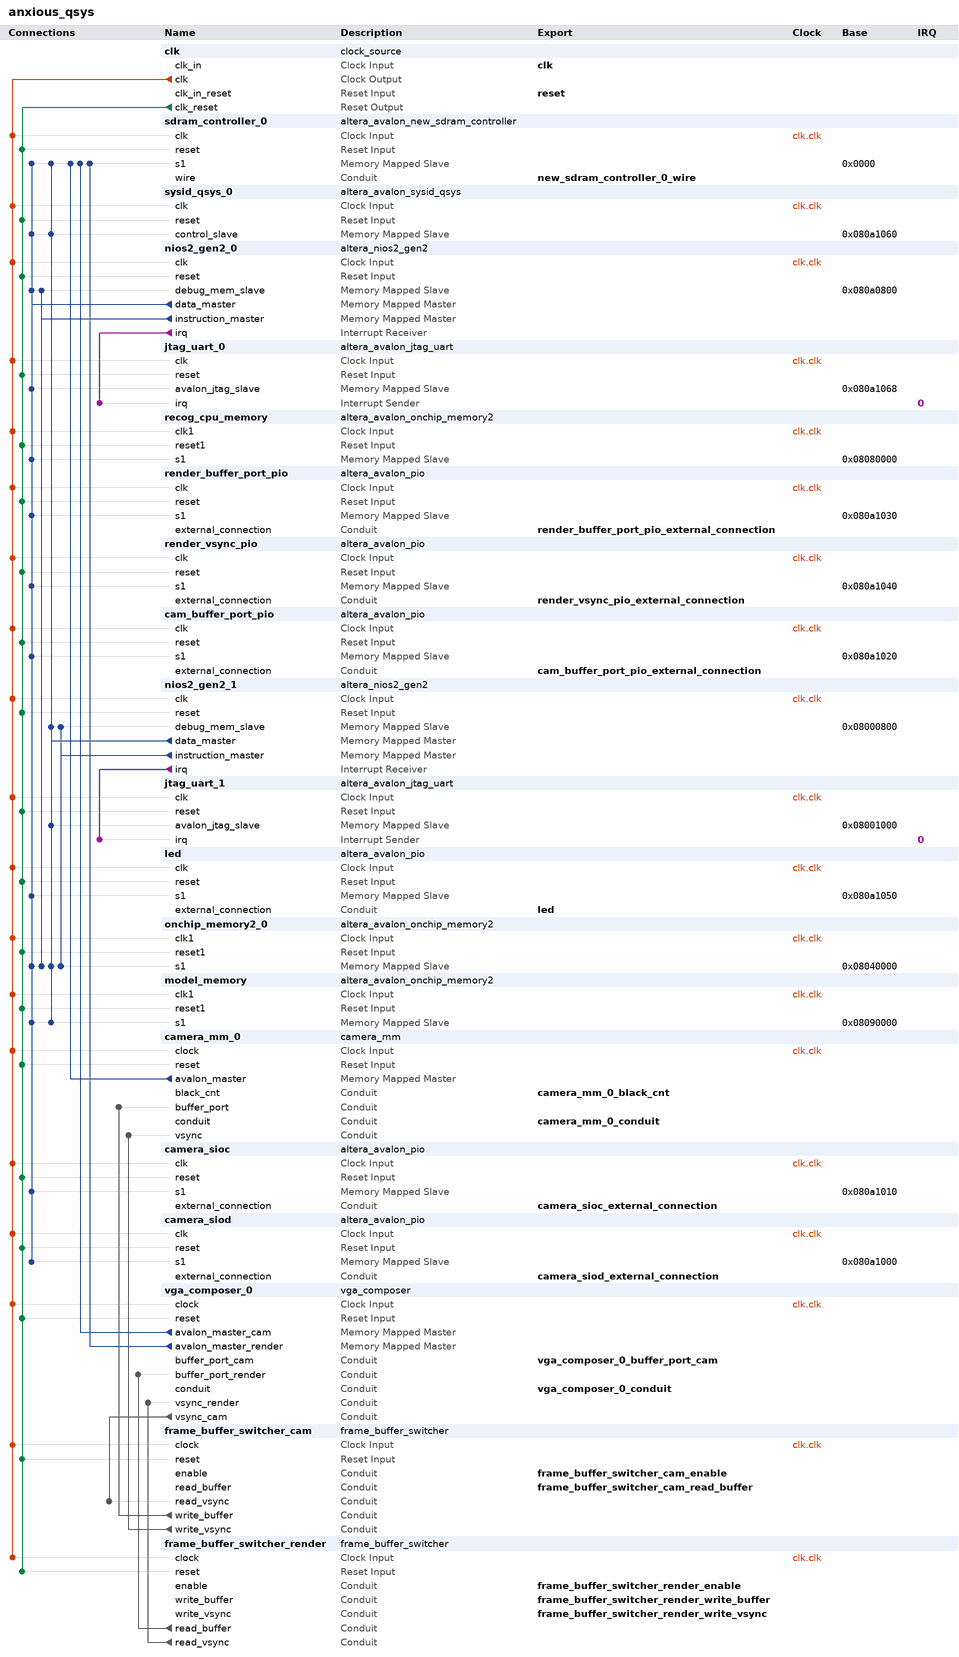
[diagram p0: system contents]
# Platform Designer (Qsys) system anxious_qsys, Cyclone IV GX EP4CGX150DF31C7
# Parameters at their usual value, and those the tool derives, are not listed.
package require -exact qsys 15.0
create_system anxious_qsys
set_project_property DEVICE_FAMILY {Cyclone IV GX}
set_project_property DEVICE EP4CGX150DF31C7

add_instance clk clock_source 15.0
set_instance_parameter_value clk clockFrequency 50000000

add_instance sdram_controller_0 altera_avalon_new_sdram_controller 15.0
set_instance_parameter_value sdram_controller_0 TAC 5.5
set_instance_parameter_value sdram_controller_0 TRCD 20.0
set_instance_parameter_value sdram_controller_0 TRP 20.0
set_instance_parameter_value sdram_controller_0 casLatency 3
set_instance_parameter_value sdram_controller_0 columnWidth 10
set_instance_parameter_value sdram_controller_0 dataWidth 32
set_instance_parameter_value sdram_controller_0 generateSimulationModel true
set_instance_parameter_value sdram_controller_0 initRefreshCommands 8
set_instance_parameter_value sdram_controller_0 model single_Micron_MT48LC4M32B2_7_chip
set_instance_parameter_value sdram_controller_0 numberOfBanks 4
set_instance_parameter_value sdram_controller_0 numberOfChipSelects 1
set_instance_parameter_value sdram_controller_0 powerUpDelay 100.0
set_instance_parameter_value sdram_controller_0 refreshPeriod 7.8125
set_instance_parameter_value sdram_controller_0 rowWidth 13

add_instance sysid_qsys_0 altera_avalon_sysid_qsys 15.0
set_instance_parameter_value sysid_qsys_0 id 286331153

add_instance nios2_gen2_0 altera_nios2_gen2 15.0
set_instance_parameter_value nios2_gen2_0 dcache_size 4096
set_instance_parameter_value nios2_gen2_0 dividerType srt2
set_instance_parameter_value nios2_gen2_0 exceptionSlave onchip_memory2_0.s1
set_instance_parameter_value nios2_gen2_0 icache_size 4096
set_instance_parameter_value nios2_gen2_0 impl Fast
set_instance_parameter_value nios2_gen2_0 resetSlave onchip_memory2_0.s1

add_instance jtag_uart_0 altera_avalon_jtag_uart 15.0
set_instance_parameter_value jtag_uart_0 simInteractiveOptions NO_INTERACTIVE_WINDOWS

add_instance recog_cpu_memory altera_avalon_onchip_memory2 15.0
set_instance_parameter_value recog_cpu_memory dataWidth 32
set_instance_parameter_value recog_cpu_memory dualPort false
set_instance_parameter_value recog_cpu_memory initMemContent true
set_instance_parameter_value recog_cpu_memory initializationFileName onchip_mem.hex
set_instance_parameter_value recog_cpu_memory memorySize 65536

add_instance render_buffer_port_pio altera_avalon_pio 15.0
set_instance_parameter_value render_buffer_port_pio direction Input
set_instance_parameter_value render_buffer_port_pio width 2

add_instance render_vsync_pio altera_avalon_pio 15.0
set_instance_parameter_value render_vsync_pio direction Output
set_instance_parameter_value render_vsync_pio width 1

add_instance cam_buffer_port_pio altera_avalon_pio 15.0
set_instance_parameter_value cam_buffer_port_pio direction Input
set_instance_parameter_value cam_buffer_port_pio width 2

add_instance nios2_gen2_1 altera_nios2_gen2 15.0
set_instance_parameter_value nios2_gen2_1 cpuID 1
set_instance_parameter_value nios2_gen2_1 dcache_size 2048
set_instance_parameter_value nios2_gen2_1 exceptionOffset 90144
set_instance_parameter_value nios2_gen2_1 exceptionSlave onchip_memory2_0.s1
set_instance_parameter_value nios2_gen2_1 icache_size 4096
set_instance_parameter_value nios2_gen2_1 impl Fast
set_instance_parameter_value nios2_gen2_1 mul_64_impl 1
set_instance_parameter_value nios2_gen2_1 resetOffset 90112
set_instance_parameter_value nios2_gen2_1 resetSlave onchip_memory2_0.s1

add_instance jtag_uart_1 altera_avalon_jtag_uart 15.0
set_instance_parameter_value jtag_uart_1 simInteractiveOptions NO_INTERACTIVE_WINDOWS

add_instance led altera_avalon_pio 15.0
set_instance_parameter_value led direction Output
set_instance_parameter_value led width 8

add_instance onchip_memory2_0 altera_avalon_onchip_memory2 15.0
set_instance_parameter_value onchip_memory2_0 dataWidth 32
set_instance_parameter_value onchip_memory2_0 dualPort false
set_instance_parameter_value onchip_memory2_0 initMemContent true
set_instance_parameter_value onchip_memory2_0 initializationFileName onchip_mem.hex
set_instance_parameter_value onchip_memory2_0 memorySize 204800

add_instance model_memory altera_avalon_onchip_memory2 15.0
set_instance_parameter_value model_memory dataWidth 32
set_instance_parameter_value model_memory dualPort false
set_instance_parameter_value model_memory initMemContent true
set_instance_parameter_value model_memory initializationFileName onchip_mem.hex
set_instance_parameter_value model_memory memorySize 65536

add_instance camera_mm_0 camera_mm 2.0
set_instance_parameter_value camera_mm_0 ADDR_WIDTH 27
set_instance_parameter_value camera_mm_0 BANK 0
set_instance_parameter_value camera_mm_0 DATA_WIDTH 32
set_instance_parameter_value camera_mm_0 FIFO_LENGTH_LOG_2 6
set_instance_parameter_value camera_mm_0 FRAME_PIXELS 307200

add_instance camera_sioc altera_avalon_pio 15.0
set_instance_parameter_value camera_sioc direction Output
set_instance_parameter_value camera_sioc width 1

add_instance camera_siod altera_avalon_pio 15.0
set_instance_parameter_value camera_siod direction Bidir
set_instance_parameter_value camera_siod width 1

add_instance vga_composer_0 vga_composer 1.0
set_instance_parameter_value vga_composer_0 ADDR_WIDTH 27
set_instance_parameter_value vga_composer_0 CAM_BANK 0
set_instance_parameter_value vga_composer_0 DATA_WIDTH 32
set_instance_parameter_value vga_composer_0 FIFO_LENGTH_LOG_2 6
set_instance_parameter_value vga_composer_0 RENDER_BANK 1

add_instance frame_buffer_switcher_cam frame_buffer_switcher 1.0

add_instance frame_buffer_switcher_render frame_buffer_switcher 1.0

# connections
add_connection clk.clk cam_buffer_port_pio.clk clock
add_connection clk.clk camera_mm_0.clock clock
add_connection clk.clk camera_sioc.clk clock
add_connection clk.clk camera_siod.clk clock
add_connection clk.clk frame_buffer_switcher_cam.clock clock
add_connection clk.clk frame_buffer_switcher_render.clock clock
add_connection clk.clk jtag_uart_0.clk clock
add_connection clk.clk jtag_uart_1.clk clock
add_connection clk.clk led.clk clock
add_connection clk.clk model_memory.clk1 clock
add_connection clk.clk nios2_gen2_0.clk clock
add_connection clk.clk nios2_gen2_1.clk clock
add_connection clk.clk onchip_memory2_0.clk1 clock
add_connection clk.clk recog_cpu_memory.clk1 clock
add_connection clk.clk render_buffer_port_pio.clk clock
add_connection clk.clk render_vsync_pio.clk clock
add_connection clk.clk sdram_controller_0.clk clock
add_connection clk.clk sysid_qsys_0.clk clock
add_connection clk.clk vga_composer_0.clock clock
add_connection clk.clk_reset cam_buffer_port_pio.reset reset
add_connection clk.clk_reset camera_mm_0.reset reset
add_connection clk.clk_reset camera_sioc.reset reset
add_connection clk.clk_reset camera_siod.reset reset
add_connection clk.clk_reset frame_buffer_switcher_cam.reset reset
add_connection clk.clk_reset frame_buffer_switcher_render.reset reset
add_connection clk.clk_reset jtag_uart_0.reset reset
add_connection clk.clk_reset jtag_uart_1.reset reset
add_connection clk.clk_reset led.reset reset
add_connection clk.clk_reset model_memory.reset1 reset
add_connection clk.clk_reset nios2_gen2_0.reset reset
add_connection clk.clk_reset nios2_gen2_1.reset reset
add_connection clk.clk_reset onchip_memory2_0.reset1 reset
add_connection clk.clk_reset recog_cpu_memory.reset1 reset
add_connection clk.clk_reset render_buffer_port_pio.reset reset
add_connection clk.clk_reset render_vsync_pio.reset reset
add_connection clk.clk_reset sdram_controller_0.reset reset
add_connection clk.clk_reset sysid_qsys_0.reset reset
add_connection clk.clk_reset vga_composer_0.reset reset
add_connection camera_mm_0.avalon_master sdram_controller_0.s1 avalon
set_connection_parameter_value camera_mm_0.avalon_master/sdram_controller_0.s1 baseAddress 0x0000
add_connection nios2_gen2_0.data_master cam_buffer_port_pio.s1 avalon
set_connection_parameter_value nios2_gen2_0.data_master/cam_buffer_port_pio.s1 baseAddress 0x080a1020
add_connection nios2_gen2_0.data_master camera_sioc.s1 avalon
set_connection_parameter_value nios2_gen2_0.data_master/camera_sioc.s1 baseAddress 0x080a1010
add_connection nios2_gen2_0.data_master camera_siod.s1 avalon
set_connection_parameter_value nios2_gen2_0.data_master/camera_siod.s1 baseAddress 0x080a1000
add_connection nios2_gen2_0.data_master jtag_uart_0.avalon_jtag_slave avalon
set_connection_parameter_value nios2_gen2_0.data_master/jtag_uart_0.avalon_jtag_slave baseAddress 0x080a1068
add_connection nios2_gen2_0.data_master led.s1 avalon
set_connection_parameter_value nios2_gen2_0.data_master/led.s1 baseAddress 0x080a1050
add_connection nios2_gen2_0.data_master model_memory.s1 avalon
set_connection_parameter_value nios2_gen2_0.data_master/model_memory.s1 baseAddress 0x08090000
add_connection nios2_gen2_0.data_master nios2_gen2_0.debug_mem_slave avalon
set_connection_parameter_value nios2_gen2_0.data_master/nios2_gen2_0.debug_mem_slave baseAddress 0x080a0800
add_connection nios2_gen2_0.data_master onchip_memory2_0.s1 avalon
set_connection_parameter_value nios2_gen2_0.data_master/onchip_memory2_0.s1 baseAddress 0x08040000
add_connection nios2_gen2_0.data_master recog_cpu_memory.s1 avalon
set_connection_parameter_value nios2_gen2_0.data_master/recog_cpu_memory.s1 baseAddress 0x08080000
add_connection nios2_gen2_0.data_master render_buffer_port_pio.s1 avalon
set_connection_parameter_value nios2_gen2_0.data_master/render_buffer_port_pio.s1 baseAddress 0x080a1030
add_connection nios2_gen2_0.data_master render_vsync_pio.s1 avalon
set_connection_parameter_value nios2_gen2_0.data_master/render_vsync_pio.s1 baseAddress 0x080a1040
add_connection nios2_gen2_0.data_master sdram_controller_0.s1 avalon
set_connection_parameter_value nios2_gen2_0.data_master/sdram_controller_0.s1 baseAddress 0x0000
add_connection nios2_gen2_0.data_master sysid_qsys_0.control_slave avalon
set_connection_parameter_value nios2_gen2_0.data_master/sysid_qsys_0.control_slave baseAddress 0x080a1060
add_connection nios2_gen2_0.instruction_master nios2_gen2_0.debug_mem_slave avalon
set_connection_parameter_value nios2_gen2_0.instruction_master/nios2_gen2_0.debug_mem_slave baseAddress 0x080a0800
add_connection nios2_gen2_0.instruction_master onchip_memory2_0.s1 avalon
set_connection_parameter_value nios2_gen2_0.instruction_master/onchip_memory2_0.s1 baseAddress 0x08040000
add_connection nios2_gen2_1.data_master jtag_uart_1.avalon_jtag_slave avalon
set_connection_parameter_value nios2_gen2_1.data_master/jtag_uart_1.avalon_jtag_slave baseAddress 0x08001000
add_connection nios2_gen2_1.data_master model_memory.s1 avalon
set_connection_parameter_value nios2_gen2_1.data_master/model_memory.s1 baseAddress 0x08090000
add_connection nios2_gen2_1.data_master nios2_gen2_1.debug_mem_slave avalon
set_connection_parameter_value nios2_gen2_1.data_master/nios2_gen2_1.debug_mem_slave baseAddress 0x08000800
add_connection nios2_gen2_1.data_master onchip_memory2_0.s1 avalon
set_connection_parameter_value nios2_gen2_1.data_master/onchip_memory2_0.s1 baseAddress 0x08040000
add_connection nios2_gen2_1.data_master sdram_controller_0.s1 avalon
set_connection_parameter_value nios2_gen2_1.data_master/sdram_controller_0.s1 baseAddress 0x0000
add_connection nios2_gen2_1.data_master sysid_qsys_0.control_slave avalon
set_connection_parameter_value nios2_gen2_1.data_master/sysid_qsys_0.control_slave baseAddress 0x080a1060
add_connection nios2_gen2_1.instruction_master nios2_gen2_1.debug_mem_slave avalon
set_connection_parameter_value nios2_gen2_1.instruction_master/nios2_gen2_1.debug_mem_slave baseAddress 0x08000800
add_connection nios2_gen2_1.instruction_master onchip_memory2_0.s1 avalon
set_connection_parameter_value nios2_gen2_1.instruction_master/onchip_memory2_0.s1 baseAddress 0x08040000
add_connection vga_composer_0.avalon_master_cam sdram_controller_0.s1 avalon
set_connection_parameter_value vga_composer_0.avalon_master_cam/sdram_controller_0.s1 baseAddress 0x0000
add_connection vga_composer_0.avalon_master_render sdram_controller_0.s1 avalon
set_connection_parameter_value vga_composer_0.avalon_master_render/sdram_controller_0.s1 baseAddress 0x0000
add_connection frame_buffer_switcher_cam.write_buffer camera_mm_0.buffer_port conduit
add_connection frame_buffer_switcher_cam.write_vsync camera_mm_0.vsync conduit
add_connection frame_buffer_switcher_render.read_buffer vga_composer_0.buffer_port_render conduit
add_connection frame_buffer_switcher_render.read_vsync vga_composer_0.vsync_render conduit
add_connection vga_composer_0.vsync_cam frame_buffer_switcher_cam.read_vsync conduit
add_connection nios2_gen2_0.irq jtag_uart_0.irq interrupt
set_connection_parameter_value nios2_gen2_0.irq/jtag_uart_0.irq irqNumber 0
add_connection nios2_gen2_1.irq jtag_uart_1.irq interrupt
set_connection_parameter_value nios2_gen2_1.irq/jtag_uart_1.irq irqNumber 0

# exported interfaces
add_interface cam_buffer_port_pio_external_connection conduit end
set_interface_property cam_buffer_port_pio_external_connection EXPORT_OF cam_buffer_port_pio.external_connection
add_interface camera_mm_0_black_cnt conduit end
set_interface_property camera_mm_0_black_cnt EXPORT_OF camera_mm_0.black_cnt
add_interface camera_mm_0_conduit conduit end
set_interface_property camera_mm_0_conduit EXPORT_OF camera_mm_0.conduit
add_interface camera_sioc_external_connection conduit end
set_interface_property camera_sioc_external_connection EXPORT_OF camera_sioc.external_connection
add_interface camera_siod_external_connection conduit end
set_interface_property camera_siod_external_connection EXPORT_OF camera_siod.external_connection
add_interface clk clock sink
set_interface_property clk EXPORT_OF clk.clk_in
add_interface frame_buffer_switcher_cam_enable conduit end
set_interface_property frame_buffer_switcher_cam_enable EXPORT_OF frame_buffer_switcher_cam.enable
add_interface frame_buffer_switcher_cam_read_buffer conduit end
set_interface_property frame_buffer_switcher_cam_read_buffer EXPORT_OF frame_buffer_switcher_cam.read_buffer
add_interface frame_buffer_switcher_render_enable conduit end
set_interface_property frame_buffer_switcher_render_enable EXPORT_OF frame_buffer_switcher_render.enable
add_interface frame_buffer_switcher_render_write_buffer conduit end
set_interface_property frame_buffer_switcher_render_write_buffer EXPORT_OF frame_buffer_switcher_render.write_buffer
add_interface frame_buffer_switcher_render_write_vsync conduit end
set_interface_property frame_buffer_switcher_render_write_vsync EXPORT_OF frame_buffer_switcher_render.write_vsync
add_interface led conduit end
set_interface_property led EXPORT_OF led.external_connection
add_interface new_sdram_controller_0_wire conduit end
set_interface_property new_sdram_controller_0_wire EXPORT_OF sdram_controller_0.wire
add_interface render_buffer_port_pio_external_connection conduit end
set_interface_property render_buffer_port_pio_external_connection EXPORT_OF render_buffer_port_pio.external_connection
add_interface render_vsync_pio_external_connection conduit end
set_interface_property render_vsync_pio_external_connection EXPORT_OF render_vsync_pio.external_connection
add_interface reset reset sink
set_interface_property reset EXPORT_OF clk.clk_in_reset
add_interface vga_composer_0_buffer_port_cam conduit end
set_interface_property vga_composer_0_buffer_port_cam EXPORT_OF vga_composer_0.buffer_port_cam
add_interface vga_composer_0_conduit conduit end
set_interface_property vga_composer_0_conduit EXPORT_OF vga_composer_0.conduit

set_interconnect_requirement {$system} qsys_mm.clockCrossingAdapter HANDSHAKE
set_interconnect_requirement {$system} qsys_mm.enableEccProtection FALSE
set_interconnect_requirement {$system} qsys_mm.insertDefaultSlave FALSE
set_interconnect_requirement {$system} qsys_mm.maxAdditionalLatency 1

save_system anxious_qsys.qsys
